# EAGLE schematic schematic_basic_tft (EAGLE 9.6.2)
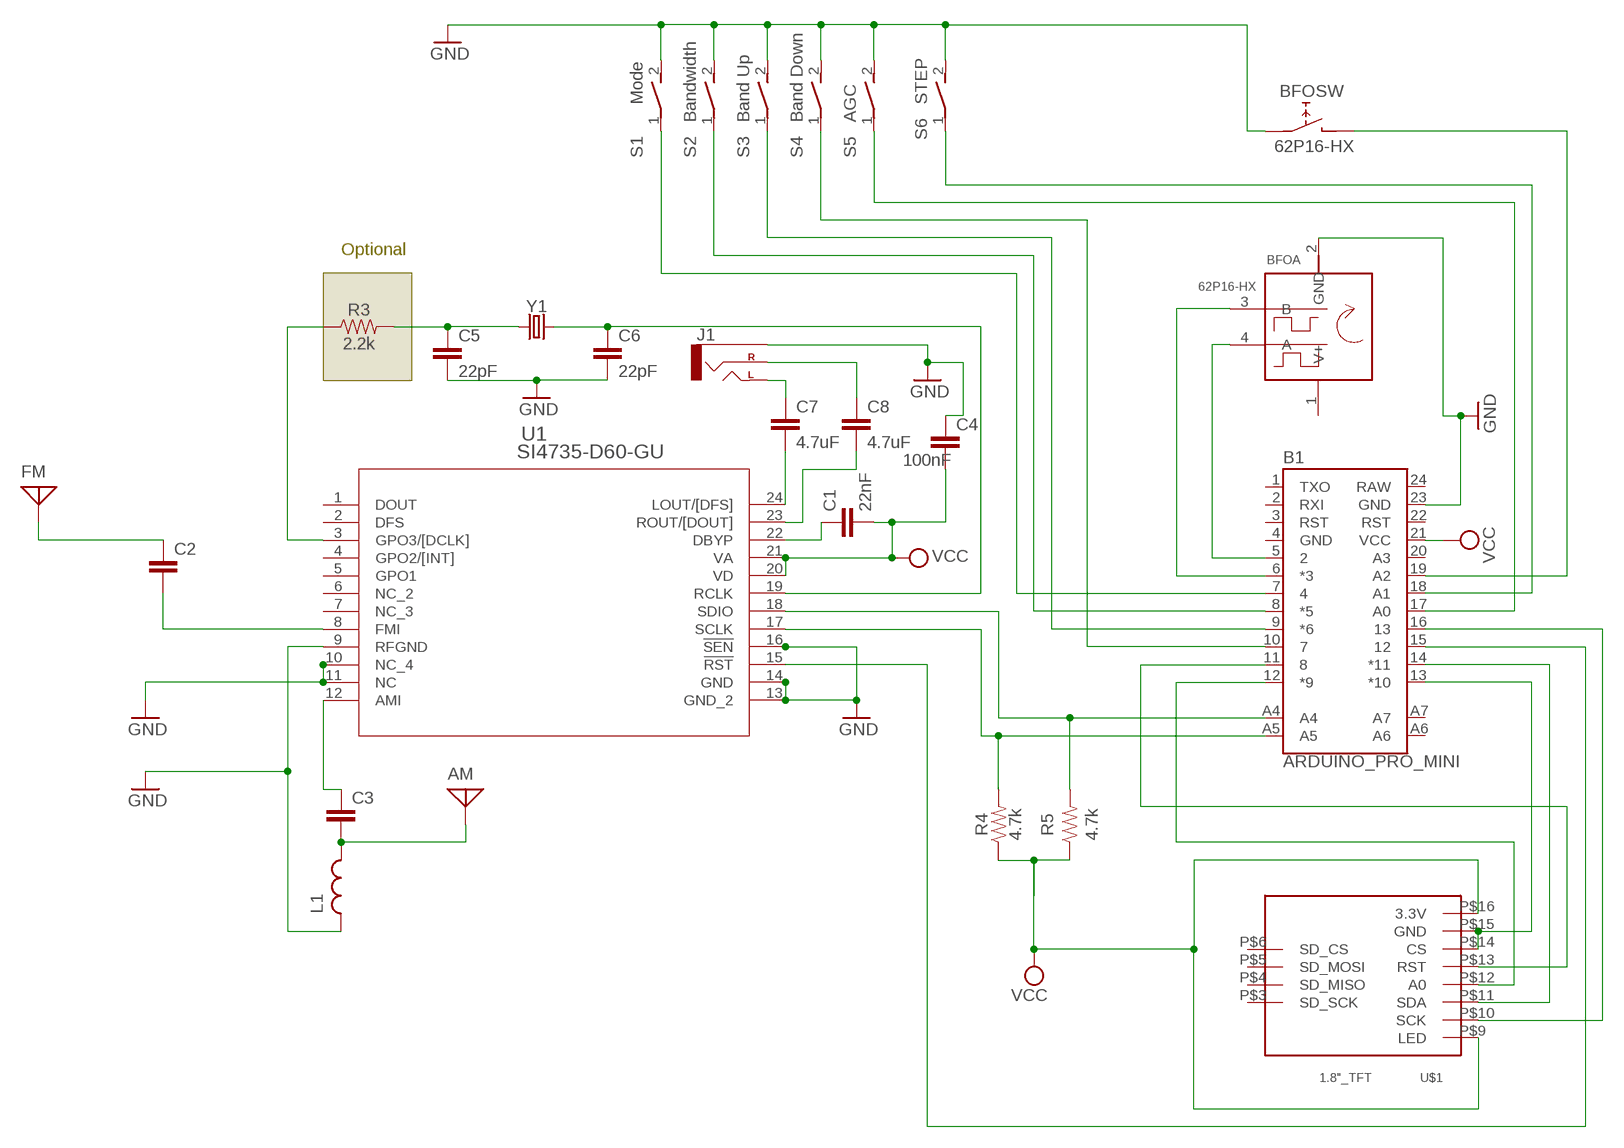
[diagram p0: schematic, sheet 1]

## Parts
AM  ANTENNA  [PAD-01]
B1  ARDUINO_PRO_MINI  [ARDUINO_PRO_MINI]
BFO  62P16-HX  [62P]
C1  22nF  22NF/22,000PF-0603-50V-10%  [0603]
C2  CXXC10B6  [XC10B6]
C3  CXXC10B6  [XC10B6]
C4  100nF  CXXC10B6  [XC10B6]
C5  22pF  22PF-0603-50V-5%  [0603]
C6  22pF  22PF-0603-50V-5%  [0603]
C7  4.7uF  4.7UF-1206-16V-(+80/-20%)  [1206]
C8  4.7uF  4.7UF-1206-16V-(+80/-20%)  [1206]
FM  ANTENNA  [PAD-01]
J1  AUDIO_JACK_2.5MMSPECIAL_POGO_PINS  [STEREOJACK2.5MM_SPECIAL_POGOPINS]
L1  L  (no package)
R3  2.2k  2.2KOHM-0603-1/10W-1%  [0603]
R4  4.7k  4.7KOHM-0603-1/10W-1%  [0603]
R5  4.7k  4.7KOHM-0603-1/10W-1%  [0603]
S1  Mode  DS01E  [DS-01]
S2  Bandwidth  DS01E  [DS-01]
S3  Band Up  DS01E  [DS-01]
S4  Band Down  DS01E  [DS-01]
S5  AGC  DS01E  [DS-01]
S6  STEP  DS01E  [DS-01]
U1  SI4735-D60-GU  [SSOP24_SIL]
U$1  1.8"_TFT  [1.8"_TFT]
Y1  CRYSTALPTH-2X6  [CRYSTAL-PTH-2X6-CYL]

## Nets
GND: B1.23(GND) BFO.2(A:GND) BFO.5(SW:D) C4.1 C5.2 C6.2 J1.RING1(SLEEVE) L1.1 S1.2 S2.2 S3.2 S4.2 S5.2 S6.2 U1.9(RFGND) U1.10(NC_4) U1.11(NC) U1.13(GND_2) U1.14(GND) U1.16(!SEN)
N$1: B1.15 U1.15(!RST)
N$2: B1.A4 R5.2 U1.18(SDIO)
N$3: C6.1 U1.19(RCLK) Y1.2
N$4: C1.1 U1.22(DBYP)
N$5: R3.1 U1.3(GPO3/[DCLK])
N$6: C7.2 U1.24(LOUT/[DFS])
N$7: C8.2 U1.23(ROUT/[DOUT])
N$8: C7.1 J1.SHIELD(LEFT)
N$9: C8.1 J1.TIP(RIGHT)
N$10: AM.1 C3.2 L1.2
N$11: C5.1 R3.2 Y1.1
N$12: C3.1 U1.12(AMI)
N$13: C2.2 U1.8(FMI)
N$14: C2.1 FM.1
N$15: B1.5 BFO.4(A:A)
N$16: B1.6(*3) BFO.3(A:B)
N$17: B1.7 S1.1
N$18: B1.8(*5) S2.1
N$19: B1.9(*6) S3.1
N$20: B1.10 S4.1
N$21: B1.17(A0) S5.1
N$22: B1.18(A1) S6.1
N$23: B1.13(*10) U$1.P$14(CS) U$1.P$15(GND)
N$24: B1.16 U$1.P$10(SCK)
N$25: B1.11 U$1.P$13(RST)
N$26: B1.14(*11) U$1.P$11(SDA)
N$27: B1.12(*9) U$1.P$12(A0)
N$28: B1.19(A2) BFO.6(SW:E)
SDA: B1.A5 R4.2 U1.17(SCLK)
VCC: B1.21(VCC) C1.2 C4.2 R4.1 R5.1 U1.20(VD) U1.21(VA) U$1.P$9(LED) U$1.P$16(3.3V)
Unconnected: B1.1(TXO) B1.2(RXI) B1.3(RST) B1.20(A3) B1.22(RST) B1.A6 B1.A7 BFO.1(A:V+) U1.1(DOUT) U1.2(DFS) U1.4(GPO2/[INT]) U1.5(GPO1) U1.6(NC_2) U1.7(NC_3) U$1.P$3(SD_SCK) U$1.P$4(SD_MISO) U$1.P$5(SD_MOSI) U$1.P$6(SD_CS)

## Notes on the sheet
- Optional

## Power pins joined to a net without a drawn wire
GND: B1.4(GND)
RAW: B1.24(RAW)

## Library data of the parts
AM FM = discrete:ANTENNA: Antenna
B1 = SparkFun-Boards:ARDUINO_PRO_MINI: SparkFun Pro Mini Pro Mini compatible footprint. Dimensions: 0.7 x 1.3" PCB Thickness: 0.8mm SparkFun Products: 3.3V/8MHz <https://www.sparkfun.com/products/11114> 5V/16MHz <https://www.sparkfun.com/products/11113>
BFO = rotary-encoder:62P*X
C1 = SparkFun-Capacitors:22NF/22,000PF: 0.022uF/22nF/22,000pF ceramic capacitors A capacitor is a passive two-terminal electrical component used to store electrical energy temporarily in an electric field.; PROD_ID: CAP-07885
C2-C4 = rcl:CX: X CAPACITOR for power line; SPICEPREFIX: C
C5 C6 = SparkFun-Capacitors:22PF: 22pF ceramic capacitors A capacitor is a passive two-terminal electrical component used to store electrical energy temporarily in an electric field.; PROD_ID: CAP-07876
C7 C8 = SparkFun-Capacitors:4.7UF: 4.7µF ceramic capacitors A capacitor is a passive two-terminal electrical component used to store electrical energy temporarily in an electric field.; PROD_ID: CAP-10300
J1 = SparkFun-Connectors:AUDIO_JACK_2.5MM: Audio Jack 2.5mm variants of PTH and SMT audio jacks. SparkFun Products: SparkFun PicoBoard <https://www.sparkfun.com/products/11888>- 2.5mm SMD
L1 = ngspice-simulation:L: INDUCTOR
R3 = SparkFun-Resistors:2.2KOHM: 2.2kΩ resistor A resistor is a passive two-terminal electrical component that implements electrical resistance as a circuit element. Resistors act to reduce current flow, and, at the same time, act to lower voltage levels within circuits. - Wikipedia; PROD_ID: RES-08272
R4 R5 = SparkFun-Resistors:4.7KOHM: 4.7kΩ resistor A resistor is a passive two-terminal electrical component that implements electrical resistance as a circuit element. Resistors act to reduce current flow, and, at the same time, act to lower voltage levels within circuits. - Wikipedia; PROD_ID: RES-07857
S1-S6 = switch-dil:DS01E: DIL/CODE SWITCH; OC_FARNELL: unknown; OC_NEWARK: unknown
U1 = si4735:SI4735-D60-GU; BUILT_BY: EMA_Cory; COPYRIGHT: Copyright (C) 2018 Accelerated Designs. All rights reserved; DATASHEET: https://www.silabs.com/documents/public/data-sheets/Si4730-31-34-35-D60.pdf; MANUFACTURER_PART_NUMBER: SI4735-D60-GU; SOURCELIBRARY: Silicon_Labs_2020-04-23; VENDOR: Silicon Labs
U$1 = tft_1_8_1_44_oled_0_96:1.8"_TFT
Y1 = SparkFun-Clocks:CRYSTAL: Crystals (Generic) These are passive quartz crystals, which can be used as a clock source for a microcontroller. Crystal's are two-terminal devices. They require external "load" capacitors to generate an oscillating signal.